# Altium schematic sheet Connector_0.SchDoc
size A2; Date: Date; CompanyName: HESSO; Engineer: Name; Address1: Route du Rawyl 47; Address2: 1950 Sion; Address3: Switzerland; ProjectName: Project Name
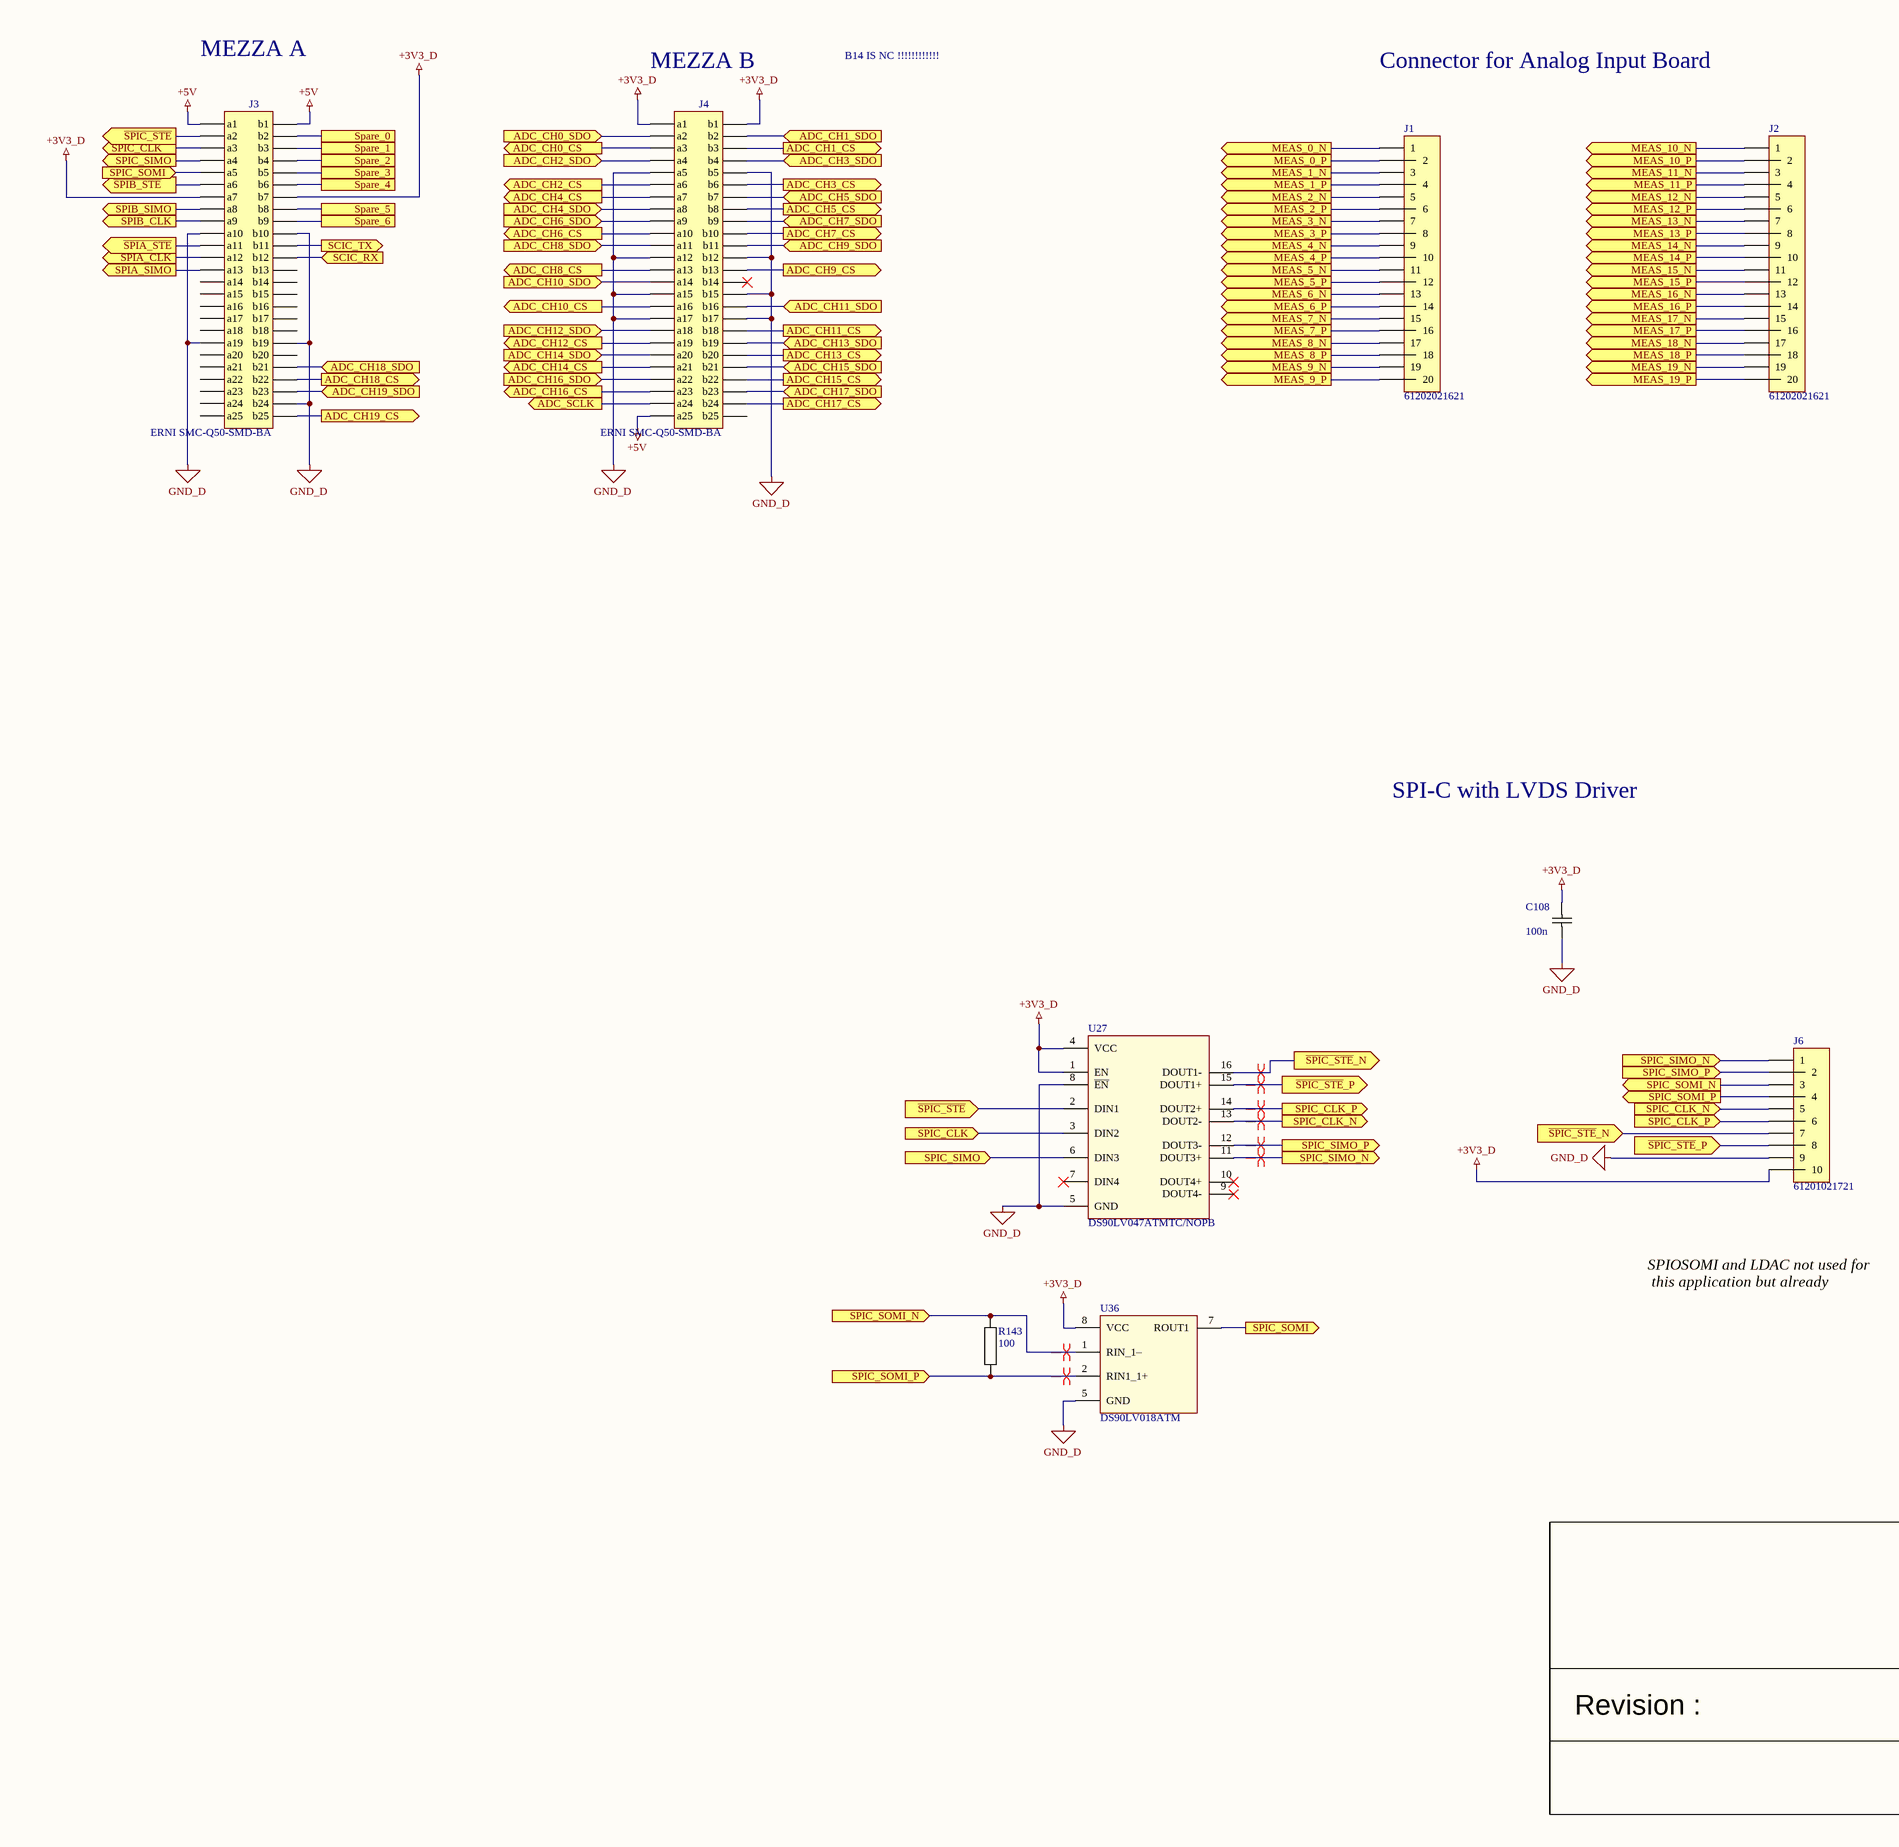
[diagram p0: Connector_0.SchDoc, left]
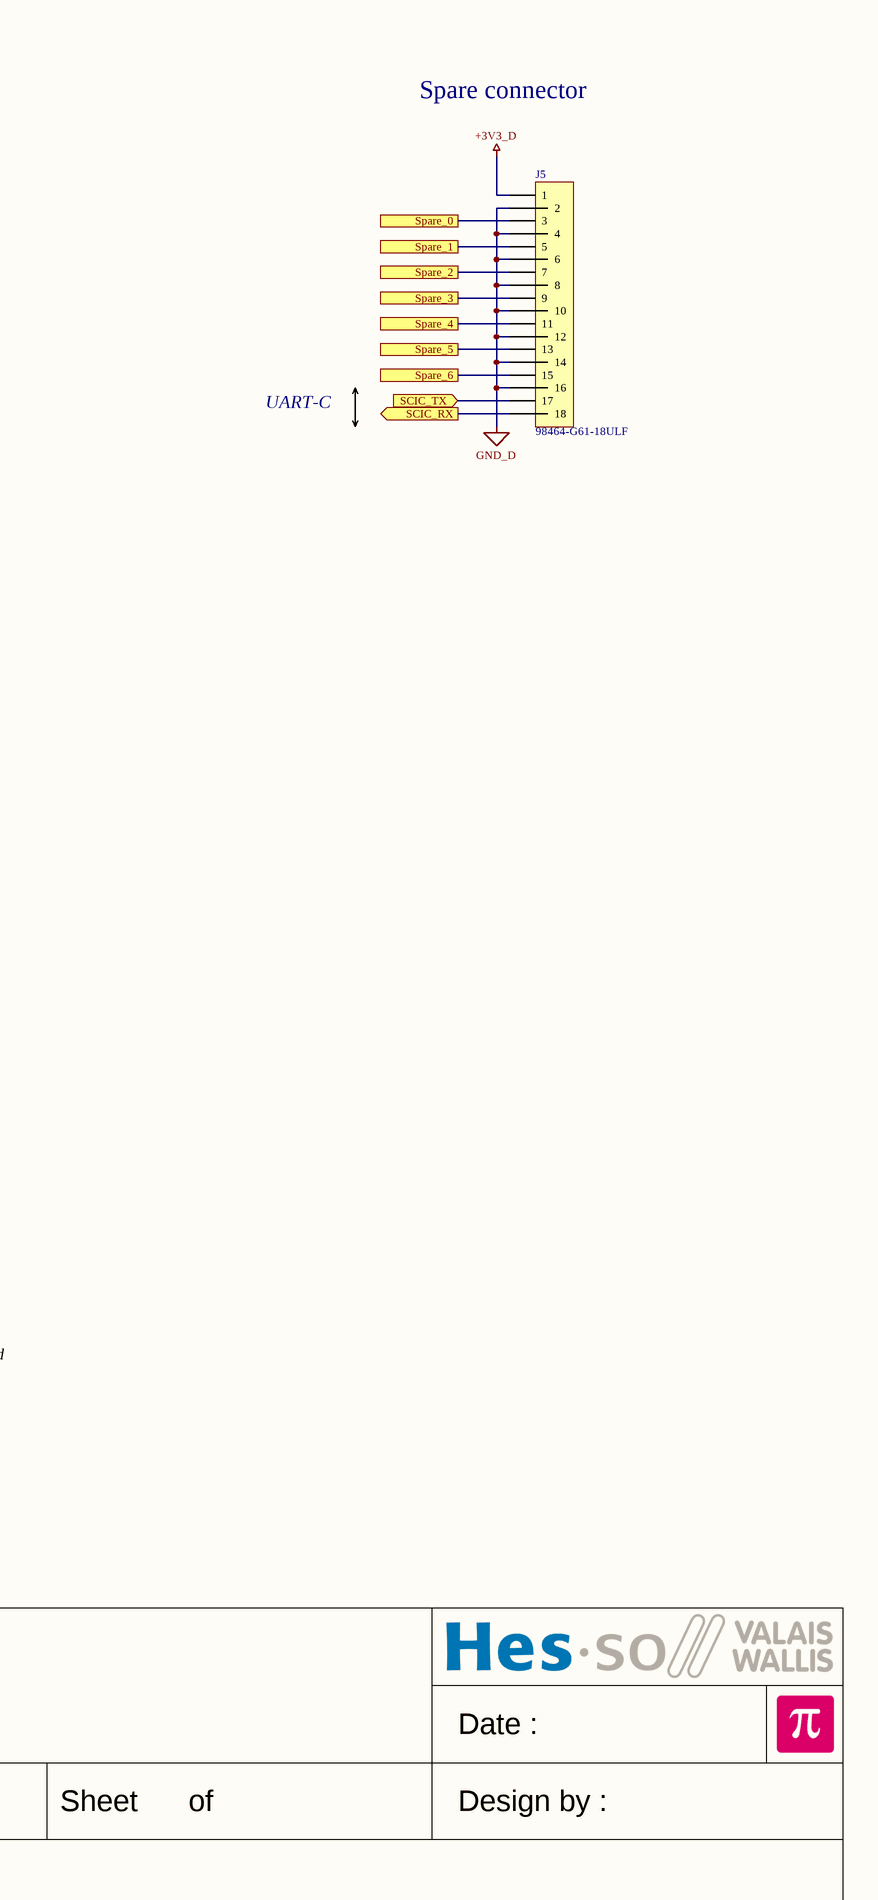
[diagram p1: Connector_0.SchDoc, right]

## Parts
C108  100n  [CAPACITOR 2012 REFLOW]
J1  61202021621  [FlatCable2x10 2.54MM RIGHT ANGLE TH]
J2  61202021621  [FlatCable2x10 2.54MM RIGHT ANGLE TH]
J3  ERNI SMC-Q50-SMD-BA  [ERNI SMC-Q50-SMD-BA]
J4  ERNI SMC-Q50-SMD-BA  [ERNI SMC-Q50-SMD-BA]
J5  98464-G61-18ULF  [FlatCable2x9 2MM Straight SMD FCI 98414-G52-18ALF]
J6  61201021721  [FlatCable2x5 2.54MM Straight TH]
R143  100  [RESISTOR 1608 REFLOW]
U27  DS90LV047ATMTC/NOPB  [TSSOP16 P0.65 C5.0x4.5 H1.1]
U36  DS90LV018ATM  [SO8 P1.27 C4.0X5.0 H1.75]

## Ports
ADC_CH0_CS (out), ADC_CH0_SDO (in), ADC_CH1_CS (out), ADC_CH1_SDO (in), ADC_CH2_CS (out), ADC_CH2_SDO (in), ADC_CH3_CS (out), ADC_CH3_SDO (in), ADC_CH4_CS (out), ADC_CH4_SDO (in), ADC_CH5_CS (out), ADC_CH5_SDO (in), ADC_CH6_CS (out), ADC_CH6_SDO (in), ADC_CH7_CS (out), ADC_CH7_SDO (in), ADC_CH8_CS (out), ADC_CH8_SDO (in), ADC_CH9_CS (out), ADC_CH9_SDO (in), ADC_CH10_CS (out), ADC_CH10_SDO (in), ADC_CH11_CS (out), ADC_CH11_SDO (in), ADC_CH12_CS (out), ADC_CH12_SDO (in), ADC_CH13_CS (out), ADC_CH13_SDO (in), ADC_CH14_CS (out), ADC_CH14_SDO (in), ADC_CH15_CS (out), ADC_CH15_SDO (in), ADC_CH16_CS (out), ADC_CH16_SDO (in), ADC_CH17_CS (out), ADC_CH17_SDO (in), ADC_CH18_CS (out), ADC_CH18_SDO (in), ADC_CH19_CS (out), ADC_CH19_SDO (in), ADC_SCLK (out), MEAS_0_N (out), MEAS_0_P (out), MEAS_1_N (out), MEAS_1_P (out), MEAS_2_N (out), MEAS_2_P (out), MEAS_3_N (out), MEAS_3_P (out), MEAS_4_N (out), MEAS_4_P (out), MEAS_5_N (out), MEAS_5_P (out), MEAS_6_N (out), MEAS_6_P (out), MEAS_7_N (out), MEAS_7_P (out), MEAS_8_N (out), MEAS_8_P (out), MEAS_9_N (out), MEAS_9_P (out), MEAS_10_N (out), MEAS_10_P (out), MEAS_11_N (out), MEAS_11_P (out), MEAS_12_N (out), MEAS_12_P (out), MEAS_13_N (out), MEAS_13_P (out), MEAS_14_N (out), MEAS_14_P (out), MEAS_15_N (out), MEAS_15_P (out), MEAS_16_N (out), MEAS_16_P (out), MEAS_17_N (out), MEAS_17_P (out), MEAS_18_N (out), MEAS_18_P (out), MEAS_19_N (out), MEAS_19_P (out), SCIC_RX (in), SCIC_RX (out), SCIC_TX (in), SCIC_TX (out), Spare_0, Spare_1, Spare_2, Spare_3, Spare_4, Spare_5, Spare_6, SPIA_CLK (out), SPIA_SIMO (out), SPIB_CLK (out), SPIB_SIMO (out), SPIC_CLK (in), SPIC_CLK (out), SPIC_CLK_N (in), SPIC_CLK_N (out), SPIC_CLK_P (in), SPIC_CLK_P (out), SPIC_SIMO (in), SPIC_SIMO (out), SPIC_SIMO_N (in), SPIC_SIMO_N (out), SPIC_SIMO_P (in), SPIC_SIMO_P (out), SPIC_SOMI (in), SPIC_SOMI (out), SPIC_SOMI_N (in), SPIC_SOMI_N (out), SPIC_SOMI_P (in), SPIC_SOMI_P (out), ~{SPIA_STE} (out), ~{SPIB_STE} (out), ~{SPIC_STE} (in), ~{SPIC_STE} (out), ~{SPIC_STE}_N (in), ~{SPIC_STE}_N (out), ~{SPIC_STE}_P (in), ~{SPIC_STE}_P (out)

## Nets
+3V3_D: C108.2 J3.a7 J3.b7 J4.a1 J4.b1 J5.1 J6.10 U27.1(EN) U27.4(VCC) U36.8(VCC)
+5V: J3.a1 J3.b1 J4.a25
GND_D: C108.1 J3.a10 J3.a19 J3.b10 J3.b19 J3.b24 J4.a5 J4.a12 J4.a15 J4.a17 J4.b5 J4.b12 J4.b15 J4.b17 J5.2 J5.4 J5.6 J5.8 J5.10 J5.12 J5.14 J5.16 J6.9 U27.5(GND) U27.8(~{EN}) U36.5(GND)
~{SPIA_STE}: J3.a11 ; port ~{SPIA_STE}
~{SPIB_STE}: J3.a6 ; port ~{SPIB_STE}
~{SPIC_STE}: J3.a2 U27.2(DIN1) ; port ~{SPIC_STE}
~{SPIC_STE}_N: J6.7 U27.16(DOUT1-) ; port ~{SPIC_STE}_N
~{SPIC_STE}_P: J6.8 U27.15(DOUT1+) ; port ~{SPIC_STE}_P
ADC_CH0_CS: J4.a3 ; port ADC_CH0_CS
ADC_CH0_SDO: J4.a2 ; port ADC_CH0_SDO
ADC_CH1_CS: J4.b3 ; port ADC_CH1_CS
ADC_CH1_SDO: J4.b2 ; port ADC_CH1_SDO
ADC_CH2_CS: J4.a6 ; port ADC_CH2_CS
ADC_CH2_SDO: J4.a4 ; port ADC_CH2_SDO
ADC_CH3_CS: J4.b6 ; port ADC_CH3_CS
ADC_CH3_SDO: J4.b4 ; port ADC_CH3_SDO
ADC_CH4_CS: J4.a7 ; port ADC_CH4_CS
ADC_CH4_SDO: J4.a8 ; port ADC_CH4_SDO
ADC_CH5_CS: J4.b8 ; port ADC_CH5_CS
ADC_CH5_SDO: J4.b7 ; port ADC_CH5_SDO
ADC_CH6_CS: J4.a10 ; port ADC_CH6_CS
ADC_CH6_SDO: J4.a9 ; port ADC_CH6_SDO
ADC_CH7_CS: J4.b10 ; port ADC_CH7_CS
ADC_CH7_SDO: J4.b9 ; port ADC_CH7_SDO
ADC_CH8_CS: J4.a13 ; port ADC_CH8_CS
ADC_CH8_SDO: J4.a11 ; port ADC_CH8_SDO
ADC_CH9_CS: J4.b13 ; port ADC_CH9_CS
ADC_CH9_SDO: J4.b11 ; port ADC_CH9_SDO
ADC_CH10_CS: J4.a16 ; port ADC_CH10_CS
ADC_CH10_SDO: J4.a14 ; port ADC_CH10_SDO
ADC_CH11_CS: J4.b18 ; port ADC_CH11_CS
ADC_CH11_SDO: J4.b16 ; port ADC_CH11_SDO
ADC_CH12_CS: J4.a19 ; port ADC_CH12_CS
ADC_CH12_SDO: J4.a18 ; port ADC_CH12_SDO
ADC_CH13_CS: J4.b20 ; port ADC_CH13_CS
ADC_CH13_SDO: J4.b19 ; port ADC_CH13_SDO
ADC_CH14_CS: J4.a21 ; port ADC_CH14_CS
ADC_CH14_SDO: J4.a20 ; port ADC_CH14_SDO
ADC_CH15_CS: J4.b22 ; port ADC_CH15_CS
ADC_CH15_SDO: J4.b21 ; port ADC_CH15_SDO
ADC_CH16_CS: J4.a23 ; port ADC_CH16_CS
ADC_CH16_SDO: J4.a22 ; port ADC_CH16_SDO
ADC_CH17_CS: J4.b24 ; port ADC_CH17_CS
ADC_CH17_SDO: J4.b23 ; port ADC_CH17_SDO
ADC_CH18_CS: J3.b22 ; port ADC_CH18_CS
ADC_CH18_SDO: J3.b21 ; port ADC_CH18_SDO
ADC_CH19_CS: J3.b25 ; port ADC_CH19_CS
ADC_CH19_SDO: J3.b23 ; port ADC_CH19_SDO
ADC_SCLK: J4.a24 ; port ADC_SCLK
MEAS_0_N: J1.1 ; port MEAS_0_N
MEAS_0_P: J1.2 ; port MEAS_0_P
MEAS_1_N: J1.3 ; port MEAS_1_N
MEAS_1_P: J1.4 ; port MEAS_1_P
MEAS_2_N: J1.5 ; port MEAS_2_N
MEAS_2_P: J1.6 ; port MEAS_2_P
MEAS_3_N: J1.7 ; port MEAS_3_N
MEAS_3_P: J1.8 ; port MEAS_3_P
MEAS_4_N: J1.9 ; port MEAS_4_N
MEAS_4_P: J1.10 ; port MEAS_4_P
MEAS_5_N: J1.11 ; port MEAS_5_N
MEAS_5_P: J1.12 ; port MEAS_5_P
MEAS_6_N: J1.13 ; port MEAS_6_N
MEAS_6_P: J1.14 ; port MEAS_6_P
MEAS_7_N: J1.15 ; port MEAS_7_N
MEAS_7_P: J1.16 ; port MEAS_7_P
MEAS_8_N: J1.17 ; port MEAS_8_N
MEAS_8_P: J1.18 ; port MEAS_8_P
MEAS_9_N: J1.19 ; port MEAS_9_N
MEAS_9_P: J1.20 ; port MEAS_9_P
MEAS_10_N: J2.1 ; port MEAS_10_N
MEAS_10_P: J2.2 ; port MEAS_10_P
MEAS_11_N: J2.3 ; port MEAS_11_N
MEAS_11_P: J2.4 ; port MEAS_11_P
MEAS_12_N: J2.5 ; port MEAS_12_N
MEAS_12_P: J2.6 ; port MEAS_12_P
MEAS_13_N: J2.7 ; port MEAS_13_N
MEAS_13_P: J2.8 ; port MEAS_13_P
MEAS_14_N: J2.9 ; port MEAS_14_N
MEAS_14_P: J2.10 ; port MEAS_14_P
MEAS_15_N: J2.11 ; port MEAS_15_N
MEAS_15_P: J2.12 ; port MEAS_15_P
MEAS_16_N: J2.13 ; port MEAS_16_N
MEAS_16_P: J2.14 ; port MEAS_16_P
MEAS_17_N: J2.15 ; port MEAS_17_N
MEAS_17_P: J2.16 ; port MEAS_17_P
MEAS_18_N: J2.17 ; port MEAS_18_N
MEAS_18_P: J2.18 ; port MEAS_18_P
MEAS_19_N: J2.19 ; port MEAS_19_N
MEAS_19_P: J2.20 ; port MEAS_19_P
SCIC_RX: J3.b12 J5.18 ; port SCIC_RX
SCIC_TX: J3.b11 J5.17 ; port SCIC_TX
Spare_0: J3.b2 J5.3 ; port Spare_0
Spare_1: J3.b3 J5.5 ; port Spare_1
Spare_2: J3.b4 J5.7 ; port Spare_2
Spare_3: J3.b5 J5.9 ; port Spare_3
Spare_4: J3.b6 J5.11 ; port Spare_4
Spare_5: J3.b8 J5.13 ; port Spare_5
Spare_6: J3.b9 J5.15 ; port Spare_6
SPIA_CLK: J3.a12 ; port SPIA_CLK
SPIA_SIMO: J3.a13 ; port SPIA_SIMO
SPIB_CLK: J3.a9 ; port SPIB_CLK
SPIB_SIMO: J3.a8 ; port SPIB_SIMO
SPIC_CLK: J3.a3 U27.3(DIN2) ; port SPIC_CLK
SPIC_CLK_N: J6.5 U27.13(DOUT2-) ; port SPIC_CLK_N
SPIC_CLK_P: J6.6 U27.14(DOUT2+) ; port SPIC_CLK_P
SPIC_SIMO: J3.a4 U27.6(DIN3) ; port SPIC_SIMO
SPIC_SIMO_N: J6.1 U27.11(DOUT3+) ; port SPIC_SIMO_N
SPIC_SIMO_P: J6.2 U27.12(DOUT3-) ; port SPIC_SIMO_P
SPIC_SOMI: J3.a5 U36.7(ROUT1) ; port SPIC_SOMI
SPIC_SOMI_N: J6.3 R143.1 U36.1(RIN_1–) ; port SPIC_SOMI_N
SPIC_SOMI_P: J6.4 R143.2 U36.2(RIN1_1+) ; port SPIC_SOMI_P

Not connected (* = marked no-connect by the designer): J3 a14 a15 a16 a17 a18 a20 a21 a22 a23 a24 a25 b13 b14 b15 b16 b17 b18 b20; J4 b14* b25; U27 7(DIN4)* 9(DOUT4-)* 10(DOUT4+)*

## Layout directives
differential pair: SPIC_CLK_N, SPIC_CLK_P, SPIC_SIMO_N, SPIC_SIMO_P, SPIC_SOMI_N, SPIC_SOMI_P, ~{SPIC_STE}_N, ~{SPIC_STE}_P

## Notes on the sheet
- MEZZA A
- MEZZA B
- B14 IS NC !!!!!!!!!!!!
- Connector for Analog Input Board
- Spare connector
- UART-C
- SPI-C with LVDS Driver
- SPIOSOMI and LDAC not used for
  this application but already reserved
- Date :
- Revision :
- Sheet
- of
- Design by :

## Library data of the parts
C108 = Capacitor: Capacitor X7R 10% 50V 2012(0805); Value: 100n
J1 J2 = FlatCable2x10: Manufacturer: Wurth Elektronik; Mouser No.: 710-61202021621; Value: 61202021621
J3 J4 = ERNI SMC-Q50-SMD-BA: Male 1.27 pitch 2x25 pin connector
J5 = FlatCable2x9: Manufacturer: Amphenol FCI; Mouser No.: 649-98464-G61-18ULF; Value: 98464-G61-18ULF
J6 = FlatCable2x5: Manufacturer: Wurth Elektronik; Mouser No.: 710-61201021721; Value: 61201021721
R143 = Resistor: Resistor 1% 50V 100mW 1608(0603); Value: 100
U27 = DS90LV047A: DS90LV047A 3-V LVDS Quad CMOS Differential Line Driver; Manufacturer: Texas Instruments; Value: DS90LV047ATMTC/NOPB; Mouser No.: 926-DS90LV047ATMTCNO
U36 = DS90LV018ATM: 3-V LVDS single CMOS differential line receiver; Value: DS90LV018ATM